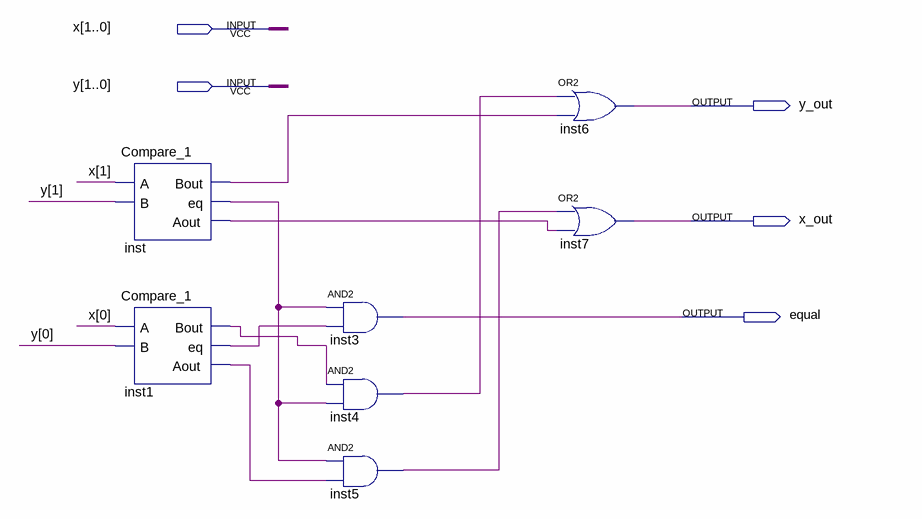
[diagram p0: schematic sheet]
// Quartus schematic Compare_2.bdf as structural Verilog: 7 symbols, 5 pins
module Compare_2 (
  input  [1:0] x,
  input  [1:0] y,
  output y_out,
  output x_out,
  output equal
);

  wire inst1_aout, inst1_bout, inst1_eq, inst4_out, inst5_out, inst_aout, inst_bout, inst_eq;

  Compare_1 inst (.A(x[1]), .B(y[1]), .Bout(inst_bout), .eq(inst_eq), .Aout(inst_aout));
  Compare_1 inst1 (.A(x[0]), .B(y[0]), .Bout(inst1_bout), .eq(inst1_eq), .Aout(inst1_aout));
  and inst3 (equal, inst_eq, inst1_eq);
  and inst4 (inst4_out, inst1_bout, inst_eq);
  and inst5 (inst5_out, inst_eq, inst1_aout);
  or inst6 (y_out, inst4_out, inst_bout);
  or inst7 (x_out, inst5_out, inst_aout);
endmodule
